# Altium project activediffprobev1.PrjPcb
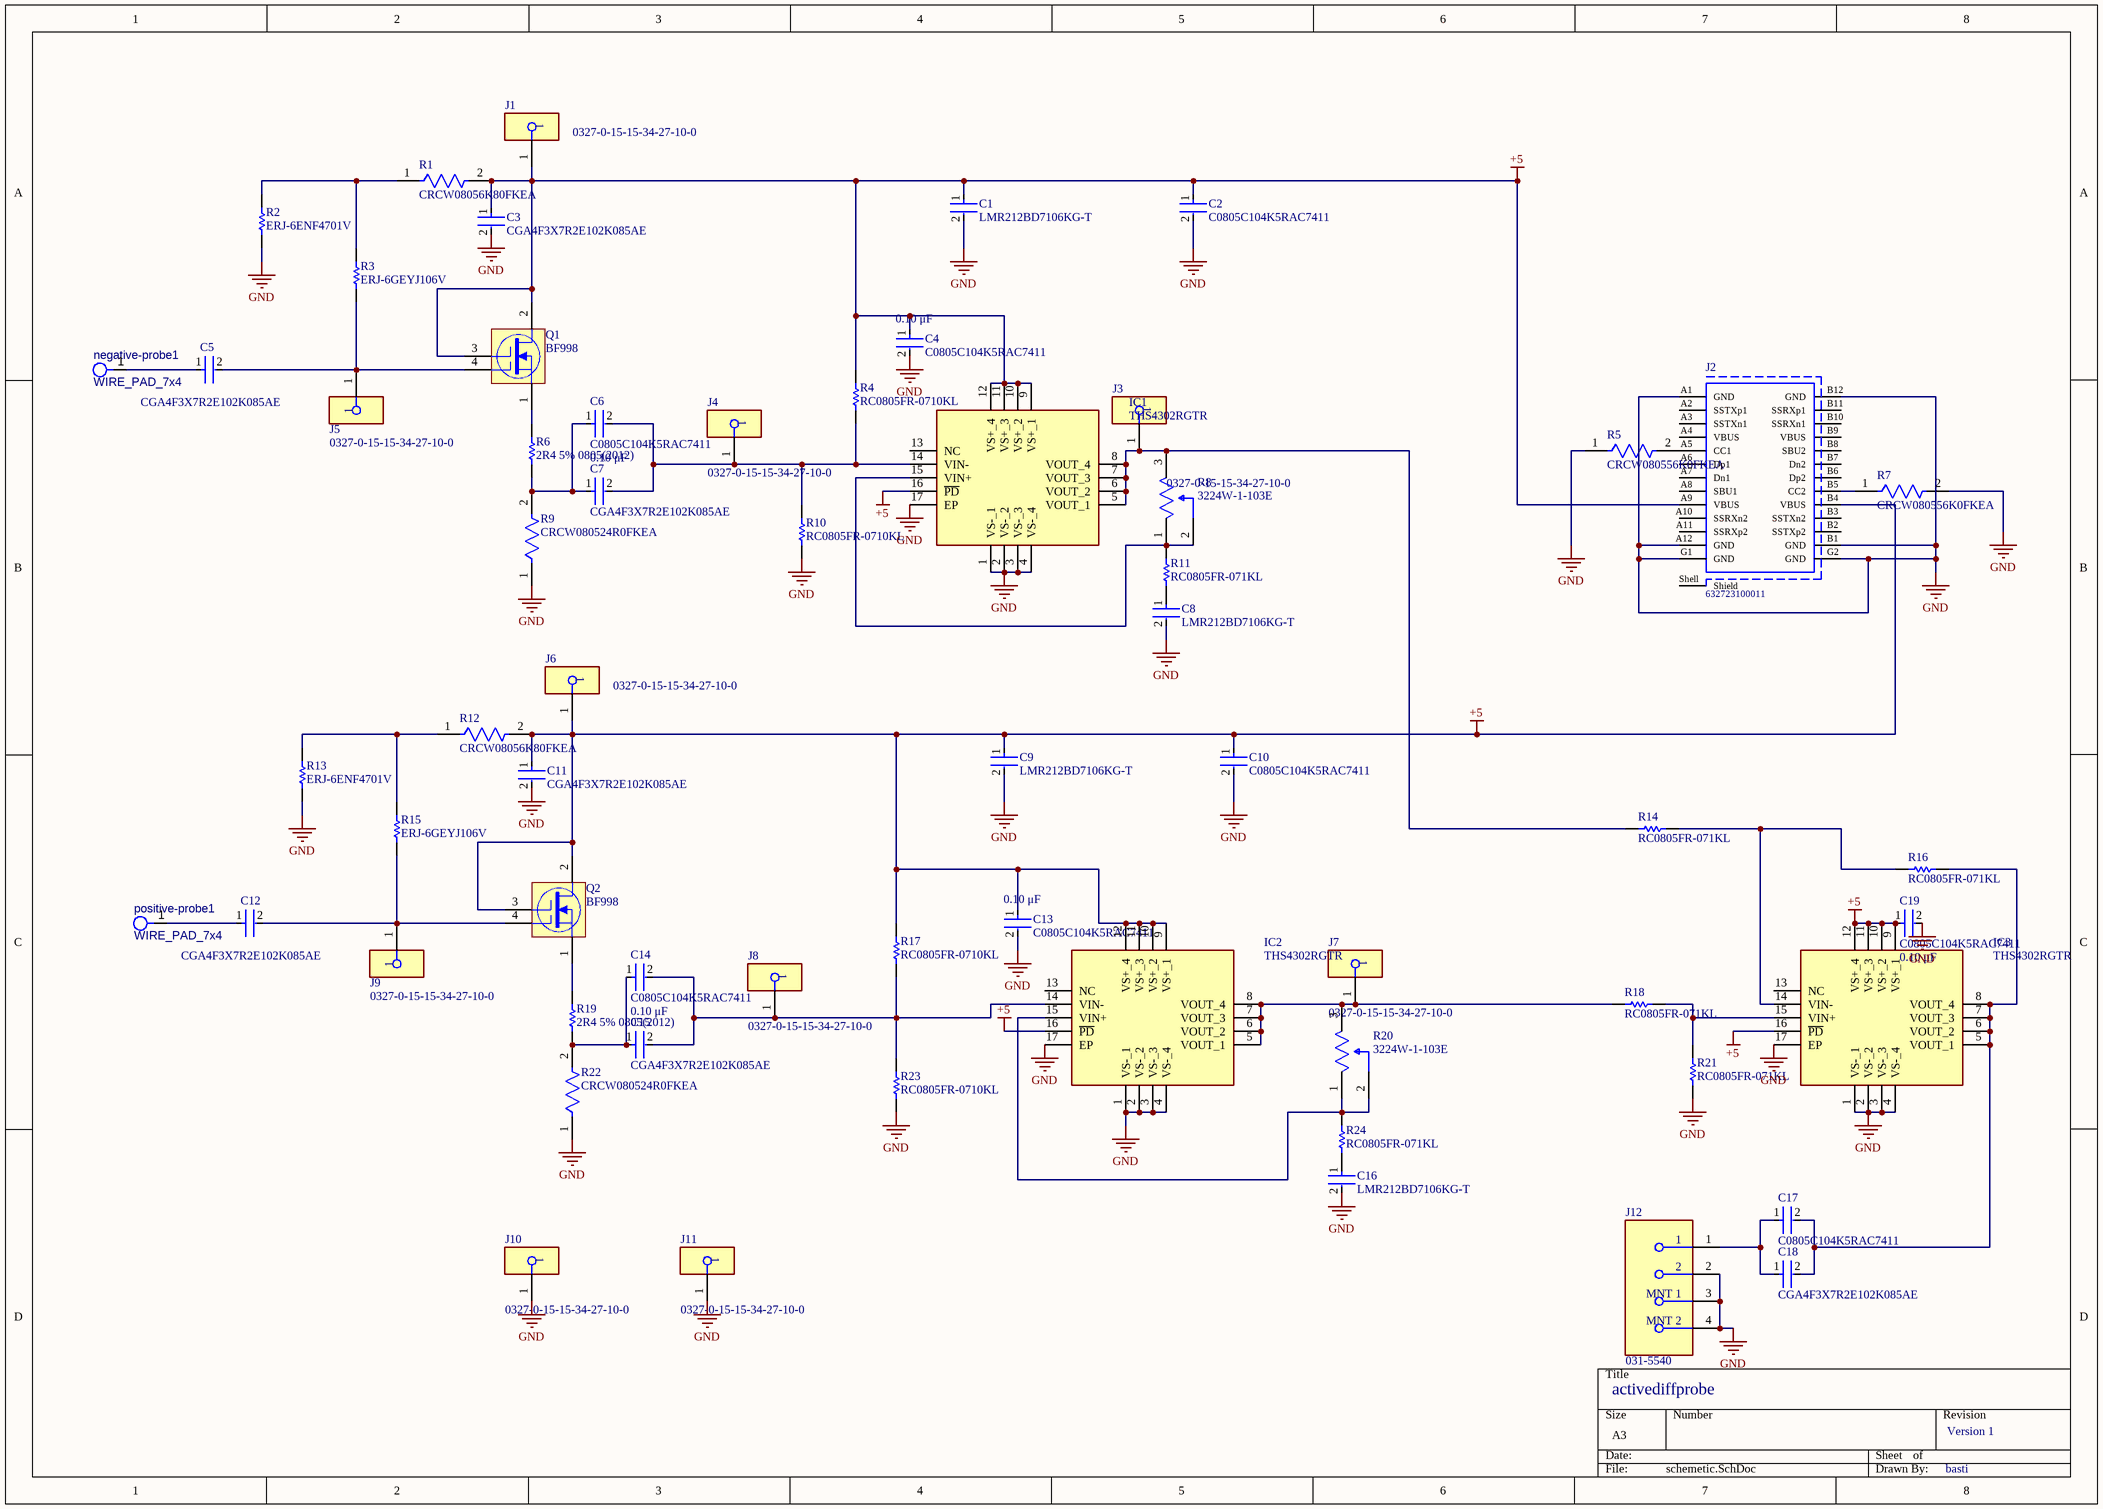
[diagram p0: schemetic.SchDoc]
1 sheet, 62 parts. Net scope: global (net labels, ports and power ports of the same name join across sheets).
Board file: activediffprobe.PcbDoc

## Sheet schemetic.SchDoc
size A3; SheetNumber: 1; SheetTotal: 1

### Parts
C1  LMR212BD7106KG-T  [FP-0805-L_2_0_0_2-W_1_25-IPC_C]
C2  C0805C104K5RAC7411  [FP-C0805C-DN-MFG]
C3  CGA4F3X7R2E102K085AE  [FP-CGA4J-IPC_B]
C4  C0805C104K5RAC7411  value 0.10 μF  [FP-C0805C-DN-MFG]
C5  CGA4F3X7R2E102K085AE  [FP-CGA4J-IPC_B]
C6  C0805C104K5RAC7411  value 0.10 μF  [FP-C0805C-DN-MFG]
C7  CGA4F3X7R2E102K085AE  [FP-CGA4J-IPC_B]
C8  LMR212BD7106KG-T  [FP-0805-L_2_0_0_2-W_1_25-IPC_C]
C9  LMR212BD7106KG-T  [FP-0805-L_2_0_0_2-W_1_25-IPC_C]
C10  C0805C104K5RAC7411  [FP-C0805C-DN-MFG]
C11  CGA4F3X7R2E102K085AE  [FP-CGA4J-IPC_B]
C12  CGA4F3X7R2E102K085AE  [FP-CGA4J-IPC_B]
C13  C0805C104K5RAC7411  value 0.10 μF  [FP-C0805C-DN-MFG]
C14  C0805C104K5RAC7411  value 0.10 μF  [FP-C0805C-DN-MFG]
C15  CGA4F3X7R2E102K085AE  [FP-CGA4J-IPC_B]
C16  LMR212BD7106KG-T  [FP-0805-L_2_0_0_2-W_1_25-IPC_C]
C17  C0805C104K5RAC7411  [FP-C0805C-DN-MFG]
C18  CGA4F3X7R2E102K085AE  [FP-CGA4J-IPC_B]
C19  C0805C104K5RAC7411  value 0.10 μF  [FP-C0805C-DN-MFG]
IC1  THS4302RGTR  [QFN50P300X300X100-17N-D]
IC2  THS4302RGTR  [QFN50P300X300X100-17N-D]
IC3  THS4302RGTR  [QFN50P300X300X100-17N-D]
J1  0327-0-15-15-34-27-10-0  [FP-0327-0-15-15-34-27-10-MFG]
J2  632723100011  [632723100011]
J3  0327-0-15-15-34-27-10-0  [FP-0327-0-15-15-34-27-10-MFG]
J4  0327-0-15-15-34-27-10-0  [FP-0327-0-15-15-34-27-10-MFG]
J5  0327-0-15-15-34-27-10-0  [FP-0327-0-15-15-34-27-10-MFG]
J6  0327-0-15-15-34-27-10-0  [FP-0327-0-15-15-34-27-10-MFG]
J7  0327-0-15-15-34-27-10-0  [FP-0327-0-15-15-34-27-10-MFG]
J8  0327-0-15-15-34-27-10-0  [FP-0327-0-15-15-34-27-10-MFG]
J9  0327-0-15-15-34-27-10-0  [FP-0327-0-15-15-34-27-10-MFG]
J10  0327-0-15-15-34-27-10-0  [FP-0327-0-15-15-34-27-10-MFG]
J11  0327-0-15-15-34-27-10-0  [FP-0327-0-15-15-34-27-10-MFG]
J12  031-5540  [FP-031-5540-MFG]
negative-probe1  WIRE_PAD_7x4  [WIRE_PAD_7x4-Footprint-1]  (no BOM)
positive-probe1  WIRE_PAD_7x4  [WIRE_PAD_7x4-Footprint-1]  (no BOM)
Q1  BF998  [INF-SOT143-4-1_V]
Q2  BF998  [INF-SOT143-4-1_V]
R1  CRCW08056K80FKEA  [FP-CRCW0805-e3-IPC_A]
R2  ERJ-6ENF4701V  [RESC2013X70X40NL20T20]
R3  ERJ-6GEYJ106V  [RESC2013X70X40LL20T20]
R4  RC0805FR-0710KL  [RESC2013X60X35NL10T20]
R5  CRCW080556K0FKEA  [FP-CRCW0805-e3-IPC_B]
R6  2R4 5% 0805(2012)  [RESC0805(2012)_L]
R7  CRCW080556K0FKEA  [FP-CRCW0805-e3-IPC_B]
R8  3224W-1-103E  [FP-3224W-MFG]
R9  CRCW080524R0FKEA  [FP-CRCW0805-e3-MFG]
R10  RC0805FR-0710KL  [RESC2013X60X35NL10T20]
R11  RC0805FR-071KL  [RESC2013X60X35ML10T20]
R12  CRCW08056K80FKEA  [FP-CRCW0805-e3-IPC_A]
R13  ERJ-6ENF4701V  [RESC2013X70X40NL20T20]
R14  RC0805FR-071KL  [RESC2013X60X35ML10T20]
R15  ERJ-6GEYJ106V  [RESC2013X70X40LL20T20]
R16  RC0805FR-071KL  [RESC2013X60X35ML10T20]
R17  RC0805FR-0710KL  [RESC2013X60X35NL10T20]
R18  RC0805FR-071KL  [RESC2013X60X35ML10T20]
R19  2R4 5% 0805(2012)  [RESC0805(2012)_L]
R20  3224W-1-103E  [FP-3224W-MFG]
R21  RC0805FR-071KL  [RESC2013X60X35ML10T20]
R22  CRCW080524R0FKEA  [FP-CRCW0805-e3-MFG]
R23  RC0805FR-0710KL  [RESC2013X60X35NL10T20]
R24  RC0805FR-071KL  [RESC2013X60X35ML10T20]

### Nets
+5: C1.1 C2.1 C3.1 C4.1 C9.1 C10.1 C11.1 C13.1 C19.1 IC1.9(VS+_1) IC1.10(VS+_2) IC1.11(VS+_3) IC1.12(VS+_4) IC1.16(~{PD}) IC2.9(VS+_1) IC2.10(VS+_2) IC2.11(VS+_3) IC2.12(VS+_4) IC2.16(~{PD}) IC3.9(VS+_1) IC3.10(VS+_2) IC3.11(VS+_3) IC3.12(VS+_4) IC3.16(~{PD}) J1.1 J2.A9(VBUS) J2.B4(VBUS) J6.1 Q1.2(D) Q1.3(G2) Q2.2(D) Q2.3(G2) R1.2 R4.2 R12.2 R17.2
GND: C1.2 C2.2 C3.2 C4.2 C8.2 C9.2 C10.2 C11.2 C13.2 C16.2 C19.2 IC1.1(VS-_1) IC1.2(VS-_2) IC1.3(VS-_3) IC1.4(VS-_4) IC1.17(EP) IC2.1(VS-_1) IC2.2(VS-_2) IC2.3(VS-_3) IC2.4(VS-_4) IC2.17(EP) IC3.1(VS-_1) IC3.2(VS-_2) IC3.3(VS-_3) IC3.4(VS-_4) IC3.17(EP) J2.A1(GND) J2.A12(GND) J2.B1(GND) J2.B12(GND) J2.G1(GND) J2.G2(GND) J10.1 J11.1 J12.2 J12.3(MNT_1) J12.4(MNT_2) R2.1 R5.1 R7.2 R9.1 R10.1 R13.1 R21.2 R22.1 R23.1
NetC5_1: C5.1 negative-probe1.1(H1)
NetC5_2: C5.2 J5.1 Q1.4(G1) R3.1
NetC6_1: C6.1 C7.1 R6.1 R9.2
NetC6_2: C6.2 C7.2 IC1.14(VIN-) J4.1 R4.1 R10.2
NetC8_1: C8.1 R11.1
NetC12_1: C12.1 positive-probe1.1(H1)
NetC12_2: C12.2 J9.1 Q2.4(G1) R15.1
NetC14_1: C14.1 C15.1 R19.1 R22.2
NetC14_2: C14.2 C15.2 IC2.14(VIN-) J8.1 R17.1 R23.2
NetC16_1: C16.1 R24.1
NetC17_1: C17.1 C18.1 J12.1
NetC17_2: C17.2 C18.2 IC3.5(VOUT_1) IC3.6(VOUT_2) IC3.7(VOUT_3) IC3.8(VOUT_4) R16.1
NetIC1_5: IC1.5(VOUT_1) IC1.6(VOUT_2) IC1.7(VOUT_3) IC1.8(VOUT_4) J3.1 R8.3(CW) R14.2
NetIC1_15: IC1.15(VIN+) R8.1(CCW) R8.2(WIPER) R11.2
NetIC2_5: IC2.5(VOUT_1) IC2.6(VOUT_2) IC2.7(VOUT_3) IC2.8(VOUT_4) J7.1 R18.2 R20.3(CW)
NetIC2_15: IC2.15(VIN+) R20.1(CCW) R20.2(WIPER) R24.2
NetIC3_14: IC3.14(VIN-) R14.1 R16.2
NetIC3_15: IC3.15(VIN+) R18.1 R21.1
NetJ2_A5: J2.A5(CC1) R5.2
NetJ2_B5: J2.B5(CC2) R7.1
NetQ1_1: Q1.1(S) R6.2
NetQ2_1: Q2.1(S) R19.2
NetR1_1: R1.1 R2.2 R3.2
NetR12_1: R12.1 R13.2 R15.2

Not connected (* = marked no-connect by the designer): IC1 13(NC); IC2 13(NC); IC3 13(NC); J2 A2(SSTXp1) A3(SSTXn1) A4(VBUS) A6(Dp1) A7(Dn1) A8(SBU1) A10(SSRXn2) A11(SSRXp2) B2(SSTXp2) B3(SSTXn2) B6(Dp2) B7(Dn2) B8(SBU2) B9(VBUS) B10(SSRXn1) B11(SSRXp1) Shell(Shield)

### Notes on the sheet
- (near J12) activediffprobe
- Version 1
- basti

### Library data of the parts
C1 C8 C9 C16 = CMP-14477-005320-1: Multilayer Ceramic Capacitor 10uF 10V X7T 10% SMD 0805 Automotive T/R; RoHS Compliant: Yes
C2 C10 C17 = CMP-2007-00277-3: C0805 0.10 μF X7R 30ppm/°C 10.00% 50 V; Manufacturer: KEMET; Material: Ceramic; Tolerance: 0.1; Capacitance: 0.10 μF; Voltage Rating: 50 V; Value: 0.10 μF; Temperature: -55°C to +125°C; Device Class L3: Ceramic Capacitors; Temperature Characteristic: X7R; Device Class L1: Passive Components; Category: Cap; Temperature Coefficient: 30ppm/°C; Manufacturer Part Number: C0805C104K5RAC7411; Temperature Range High: +125°C; Height: 0.88mm; RoHS: TRUE; ComponentLink2Description: Datasheet; Lead Free: Yes; Package: C0805C-DN; Temperature Range Low: -55°C; ComponentLink2URL: https://content.kemet.com/datasheets/KEM_C1003_C0G_SMD.pdf; Automotive: No; Ipc Land Pattern Name: CAPC200125X78; Octopart: https://octopart.com/c0805c104k5rac7411-kemet-18508045; Device Class L2: Capacitors
C3 C5 C7 C11 C12 C15 C18 = CMP-08246-002356-1: Cap Ceramic 1nF 250V X7R 10% Pad SMD 0805 +125°C Automotive T/R; Case/Package: 0805; Mount: Surface Mount; Case Code (Metric): 2012; Min Operating Temperature: -55°C; Features: Soft Termination; Packaging: Tape and Reel; Width: 0.047inch; Thickness: 0.039inch; Ratings: AEC-Q200; Tolerance: 10%; Capacitance: 1nF; Length: 0.079inch; Voltage Rating: 250V; Case Code (Imperial): 0805; Max Operating Temperature: 125°C
C4 C6 C13 C14 C19 = CMP-2007-00277-3: C0805 0.10 μF X7R 30ppm/°C 10.00% 50 V; Manufacturer: KEMET; Material: Ceramic; Tolerance: 0.1; Voltage Rating: 50 V; Temperature: -55°C to +125°C; Device Class L3: Ceramic Capacitors; Temperature Characteristic: X7R; Device Class L1: Passive Components; Category: Cap; Temperature Coefficient: 30ppm/°C; Manufacturer Part Number: C0805C104K5RAC7411; Temperature Range High: +125°C; Height: 0.88mm; RoHS: TRUE; ComponentLink2Description: Datasheet; Lead Free: Yes; Capacitance: 0.10 μF; Package: C0805C-DN; Temperature Range Low: -55°C; ComponentLink2URL: https://content.kemet.com/datasheets/KEM_C1003_C0G_SMD.pdf; Automotive: No; Ipc Land Pattern Name: CAPC200125X78; Octopart: https://octopart.com/c0805c104k5rac7411-kemet-18508045; Device Class L2: Capacitors
IC1-IC3 = THS4302RGTR: Integrated Circuit; Manufacturer_Name: Texas Instruments; Datasheet Link: http://www.ti.com/lit/gpn/ths4302; Height: 1mm; Manufacturer_Part_Number: THS4302RGTR
J1 J3-J11 = CMP-07777-000006-1: CONN PIN RCPT .032-.046 SOLDER; Number of Positions: 34; Number of Contacts: 1; Inside Diameter: 1.17mm; Pin Length: 0.206inch; Connector Type: PCB; Gender: Female; RoHS Compliant: Yes; Termination: Solder; Lead Free: Lead Free; Mount: Solder; Contact Plating: Gold; Series: 0327; Contact Material: Copper; Package Quantity: 500; Packaging: Bulk; Length: 0.206inch
J2 = CMP-1502-03213-1: USB 3.1 Type C Receptacle WR-COM, Horizontal, SMT / THT; Manufacturer: Wurth Elektronik; Working Voltage: 20VDC; Rated Current: 5A; Contact Resistance: 30mOhm; Operating Temperature: -40to105degC; Publisher: WurthElektronik; Gender: Receptacle; Part Number: 632723100011; Mounting Technology: SMT/THT; Datasheet URL: https://katalog.we-online.de/em/datasheet/632723x00011%282%29.pdf; Connector Type: USB3.1TypeC; Manufacturer URL: http://www.we-online.de; Orientation: Horizontal; Package Reference: 632723100011; Packaging: TapeandReel
J12 = CMP-20040-000002-1: CONN BNC RCPT R/A 50 OHM PCB; Manufacturer: Amphenol RF; Impedance: 50Ω; Number Of Contacts: 2; Pitch: 2.54mm; Dielectric Material: Polypropylene; Is Female: yes; Frequency: 1GHz; Conn Orientation: Right Angle; Lead Free: Yes; Device Class L2: RF / Coaxial Connectors; Digikey Description: CONN BNC RCPT R/A 50 OHM PCB; Octopart: https://octopart.com/031-5540-amphenol+rf-49742301; ComponentLink2URL: https://www.amphenolrf.com/downloads/dl/file/id/2040/product/579/031_5540_customer_drawing.pdf; Package: 0; Automotive: No; Temperature: -55°C to +85°C; Contact Material: Gold,Nickel; RoHS: TRUE; ComponentLink2Description: Datasheet; Height: 13.4mm; Category: Conn; Manufacturer Part Number: 031-5540; Temperature Range High: +85°C; Device Class L3: unset; Temperature Range Low: -55°C; Device Class L1: Connectors
negative-probe1 positive-probe1 = CMP-019-00043-3: SMD WIRE PAD 7 x 4 mm; Pins: 1
Q1 Q2 = CMP-1193-00001-1: Silicon N-Channel MOSFET Tetrode, 30 mA ID, 20 dB Gp, SOT143-4-1, Green; Manufacturer: Infineon; F (typ): 1.8 dB; Ptot (max): 200 mW; ID (max): 30 mA; Gp (typ): 20 dB; gfs (typ): 24 mS; Green: yes; ComponentLink2URL: http://www.infineon.com/dgdl/bf998series.pdf?folderId=db3a30431441fb5d0114936599851041&fileId=db3a30431441fb5d011493688fd31042&location=en.Products.RF.RF_MOSFET.Single_Non_Biased.DATASHEET.bf998series.pdf; ComponentLink3URL: http://www.infineon.com/dgdl/SOT143-Package_Overview.pdf?folderId=db3a30431936bc4b011952ce8b1b3bed&fileId=db3a30431936bc4b011952df42203c0c; PartNumber: BF998; PackageDescription: 4-Pin Small Outline Transistor Package, 1.3 x 2.9 mm Body; ComponentLink3Description: Package Specification; DatasheetVersion: Apr-2007; ComponentLink2Description: Datasheet; PackageReference: SOT143-4-1; ComponentLink1URL: http://www.infineon.com/; ComponentLink1Description: Manufacturer URL; Mounting Technology: Surface Mount
R1 R12 = CMP-2001-04088-2: RES Thick Film, 6.8kΩ, 1%, 0.125W, 100ppm/°C, 0805; Resistance: 6.8kR; Voltage Rating: 150V; Max Power Dissipation: 125mW; Termination: SMD/SMT; Number of Terminations: 2; Radiation Hardening: No; Lead Free: Lead Free; Features: Automotive AEC-Q200; Case Code (Metric): 2012; Contact Plating: Tin; Temperature Coefficient: 100ppm/°C; Tolerance: 1%; Min Operating Temperature: -55°C; Width: 0.049inch; Mount: Surface Mount; Weight: 0.000194oz; Max Operating Temperature: 155°C; Case Code (Imperial): 0805; Military Standard: Not; Depth: 1.25mm; Length: 2mm; Height: 0.45mm; Voltage Rating (DC): 150V; Case/Package: 0805; Package Quantity: 10; Packaging: Tape and Reel; Composition: Thick Film; Power Rating: 125mW
R2 R13 = CMP-2001-00550-5: Chip Resistor, 4.7 KOhm, +/- 1%, 0.125 W, -55 to 155 degC, 0805 (2012 Metric), RoHS, Tape and Reel; Manufacturer: Panasonic; Voltage Rating: 150 V; Min Operating Temperature: -55 degC; PackageReference: 0805; Mounting Technology: Surface Mount; Height: 0.6 mm; PackageDescription: 2-Pin Surface Mount Device, Body 2 x 1.25 mm; RoHSCompliant: true; Length: 2 mm; REACH SVHC: Yes; Packaging: Tape and Reel; Pins: 2; Mount: Surface Mount; ComponentLink2Description: Datasheet; ComponentLink1URL: http://www.panasonic.com/; ComponentLink1Description: Manufacturer URL; DatasheetVersion: 04/2015; Package Quantity: 5000; ComponentLink2URL: http://industrial.panasonic.com/cdbs/www-data/pdf/RDA0000/AOA0000C86.pdf; Max Operating Temperature: 155 degC
R3 R15 = CMP-2001-00340-1: 10MOhm; Manufacturer: Panasonic; Part Number: ERJ-6GEYJ106V
R4 R10 R17 R23 = CMP-1659-00013-4: Chip Resistor, 10 KOhm, +/- 1%, 0.125 W, -55 to 155 degC, 0805 (2012 Metric), RoHS, Tape and Reel; Manufacturer: Yageo; Voltage Rating: 150 V; Mount: Surface Mount; ComponentLink1Description: Manufacturer URL; ComponentLink2URL: http://www.yageo.com/documents/recent/PYu-RC_Group_51_RoHS_L_04.pdf; Pins: 2; Length: 2 mm; Min Operating Temperature: -55 degC; Height: 0.5 mm; Mounting Technology: Surface Mount; RoHSCompliant: true; REACH SVHC: No SVHC; ComponentLink1URL: http://www.yageo.com/; Max Operating Temperature: 155 degC; PackageReference: 0805; DatasheetVersion: Rev. 4, 02/2016; Package Quantity: 5000; Packaging: Tape and Reel; ComponentLink2Description: Datasheet; PackageDescription: 2-Pin Surface Mounted Device, Body 2 x 1.25 mm
R5 R7 = CMP-2001-04015-2: RES Thick Film, 56kΩ, 1%, 0.125W, 100ppm/°C, 0805; Resistance: 56kR; Power Rating: 125mW; Voltage Rating: 150V; Depth: 1.25mm; Contact Plating: Tin; Package Quantity: 10; Min Operating Temperature: -55°C; Case/Package: 0805; Packaging: Tape and Reel; Lead Free: Lead Free; Case Code (Imperial): 0805; Tolerance: 1%; Height: 0.45mm; Max Operating Temperature: 155°C; Case Code (Metric): 2012; Number of Pins: 2; Width: 1.25mm; Mount: Surface Mount; Voltage Rating (DC): 150V; Max Power Dissipation: 125mW; Weight: 0.000194oz; Termination: SMD/SMT; Length: 2mm; Radiation Hardening: No; Composition: Thick Film; Features: Automotive AEC-Q200; Number of Terminations: 2; Temperature Coefficient: 100ppm/°C; Military Standard: Not
R6 R19 = CMP-1013-00011-1: 2R4 0.125W 5% 0805 (2012 Metric)  SMD; Case-EIA: 0805; Value: 2.40 Ohm; Case-Metric: 2012; Technology: SMT; Power: 0.125 W; Tolerance: 5 %
R8 R20 = CMP-2000-05077-2: TRIMMER 10K OHM 0.25W J LEAD TOP; Manufacturer: Bourns; Tolerance: 10%; Resistance: 10kΩ; Temperature Coefficient: 100ppm/°C; Value: 10kΩ; Standoff Height: 0.2mm; Voltage Rating: 300V; Power Rating: 250mW; Device Class L3: Variable Resistors and Potentiometers; Composition: Cermet; Temperature Range Low: -65°C; Package: 3224W; ComponentLink2Description: Datasheet; Digikey Description: TRIMMER 10K OHM 0.25W J LEAD TOP; Category: Res; Mouser Description: Trimmer Resistors - SMD 4mm 10Kohms 10% Square Cermet Sealed; Temperature: -65°C to +150°C; Device Class L2: Resistors; Device Class L1: Passive Components; RoHS: TRUE; Temperature Range High: +150°C; Manufacturer Part Number: 3224W-1-103E; ComponentLink2URL: https://upverter.com/datasheet/a166fca85da25564670351d2dc712345c058bc40.pdf; Series: 3224; Height: 5.55mm; Lead Free: Yes; Octopart: https://octopart.com/3224w-1-103e-bourns-14818; Automotive: No
R9 R22 = CMP-2001-03718-2: RES Thick Film, 24Ω, 1%, 0.125W, 100ppm/°C, 0805; Voltage Rating: 150V; Power Rating: 125mW; Resistance: 24R; Package Quantity: 10; Voltage Rating (DC): 150V; Tolerance: 1%; Width: 0.049inch; Height: 0.45mm; Packaging: Tape and Reel; Max Operating Temperature: 155°C; Contact Plating: Tin; Case Code (Imperial): 0805; Mount: Surface Mount; Depth: 1.25mm; Weight: 0.000194oz; Lead Free: Lead Free; Number of Pins: 2; Radiation Hardening: No; Case/Package: 0805; Number of Terminations: 2; Min Operating Temperature: -55°C; Temperature Coefficient: 100ppm/°C; Composition: Thick Film; Max Power Dissipation: 125mW; Termination: SMD/SMT; Military Standard: Not; Case Code (Metric): 2012; Features: Automotive AEC-Q200; Length: 2mm
R11 R14 R16 R18 R21 R24 = CMP-2100-03671-1: Chip Resistor, 1 KOhm, +/- 1%, 125 mW, -55 to 155 degC, 0805 (2012 Metric), RoHS, Tape and Reel; Manufacturer: Yageo; Temperature Coefficient: 100ppm/degreesC; Voltage Rating (DC): 150V; Max Power Dissipation: 125mW; Resistance: 1KOhm; Number of Pins: 2; Number of Terminations: 2; Datasheet URL: http://www.yageo.com/NewPortal/yageodocoutput?fileName=/pdf/R-Chip/PYu-RC_Group_51_RoHS_L_5.pdf; Length: 0.079inch; Package Description: 2-Pin Surface Mounted Device, Body 2 x 1.25 mm; Depth: 1.25mm; Height: 0.024inch; Military Standard: Not; Case/Package: 0805; Package Reference: 0805; RoHSCompliant: true; Lead Free: LeadFree; Packaging: TapeandReel; Package Quantity: 1; Datasheet Version: Rev. 5, 10/2016; Tolerance: 1%; Min Operating Temperature: -55degC; Voltage Rating: 150V; Composition: ThickFilm; Case Code (Imperial): 0805; Power Rating: 125mW; Width: 0.049inch; Case Code (Metric): 2012; Manufacturer URL: http://www.yageo.com/; Max Operating Temperature: 155degC; REACH SVHC: Unknown; Termination: SMD/SMT